# EAGLE schematic container-schematic (EAGLE 9.6.2)
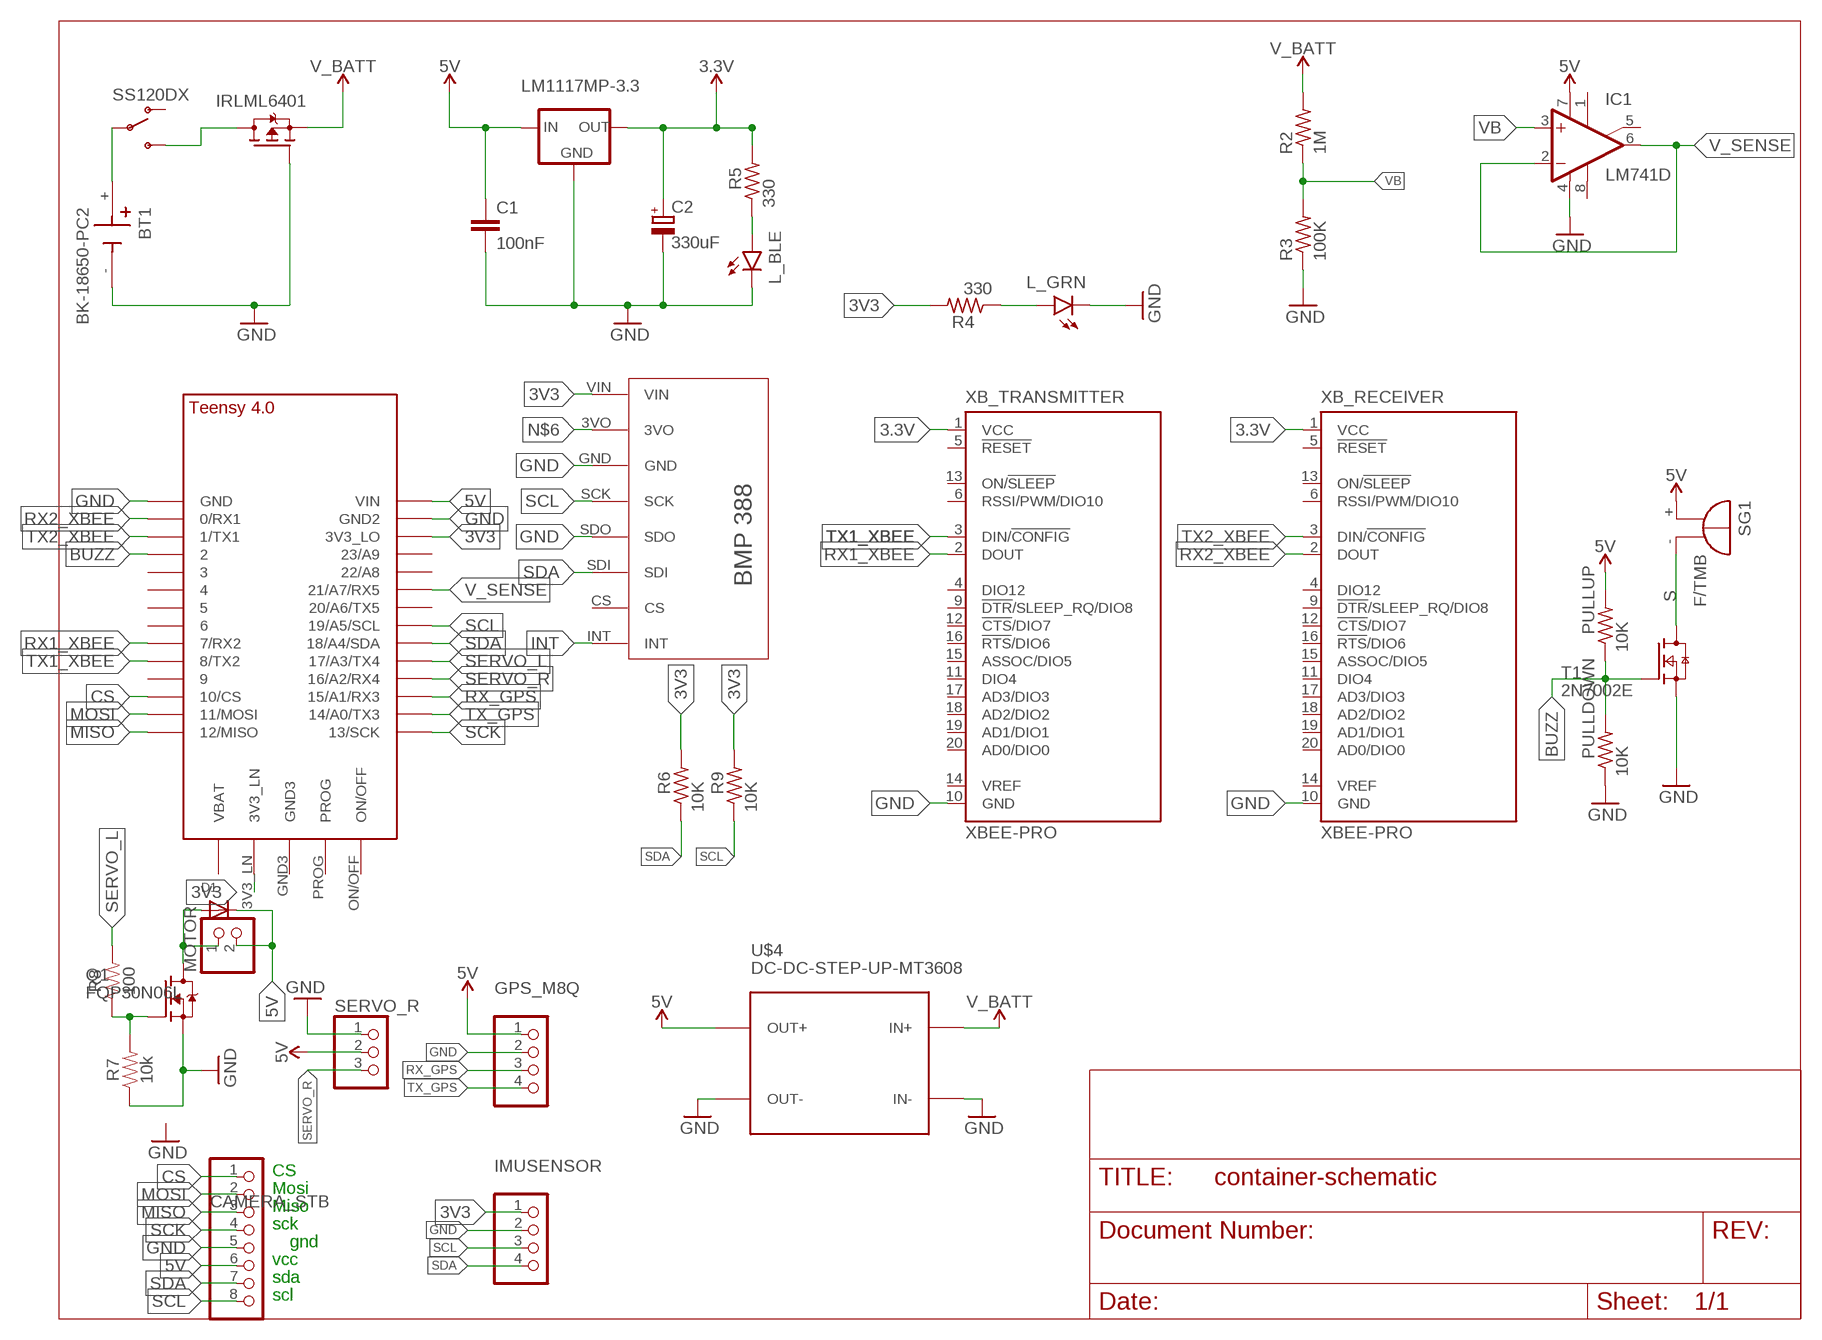
[diagram p0: schematic, sheet 1]

## Parts
BT1  BK-18650-PC2  [BAT_BK-18650-PC2]
C1  100nF  C-EUC0805  [C0805]
C2  330uF  CPOL-EUD/7343-31W  [D/7343-31W]
CAMERA_STB  PINHD-1X8  [1X08]
D1  DIODEDO-1N4148  [DO-1N4148]
GPS_M8Q  PINHD-1X4  [1X04]
IC1  LM741D  [SO08]
IC2  LM1117MP-3.3  [SOT223]
IMUSENSOR  PINHD-1X4  [1X04]
IRLML6401  MOSFET-PWIDE  [SOT23-WIDE]
L_BLE  LED1206  [LED-1206]
L_GRN  LED1206  [LED-1206]
MOTOR  PINHD-1X2  [1X02]
PULLDOWN  10K  R-US_M0805  [M0805]
PULLUP  10K  R-US_M0805  [M0805]
Q1  FQP30N06L  [TO220V]
R2  1M  R-US_M1206  [M1206]
R3  100K  R-US_M1206  [M1206]
R4  330  R-US_M0805  [M0805]
R5  330  R-US_M0805  [M0805]
R6  10K  R-US_M0805  [M0805]
R7  10k  RESISTOR0805  [0805]
R8  100  RESISTOR0805  [0805]
R9  10K  R-US_M0805  [M0805]
SERVO_R  PINHD-1X3  [1X03]
SG1  F/TMB  [F/TMB]
T1  2N7002E  [SOT23]
U$1  TEENSY_4.0-BASIC  [TEENSY_4.0-BASIC]
U$2  BMP388  [BMP388]
U$3  SS120DX  [SS12D0X]
U$4  DC-DC-STEP-UP-MT3608  [DC-DC-STEP-UP-MT3608]
XB_RECEIVER  XBEE-PRO  [XBEE-PRO]
XB_TRANSMITTER  XBEE-PRO  [XBEE-PRO]

## Nets
3.3V: C2.+ IC2.2(OUT) IC2.4(OUT) R5.2 XB_RECEIVER.1(VCC) XB_TRANSMITTER.1(VCC)
3V3: IMUSENSOR.1 R4.2 R6.2 R9.2 U$1.3V3_LN U$1.3V3_LO U$2.VIN
5V: C1.1 CAMERA_STB.6 D1.C GPS_M8Q.1 IC1.7(V+) IC2.3(IN) MOTOR.2 PULLUP.2 SERVO_R.2 SG1.+ U$1.VIN U$4.OUT+
BUZZ: PULLDOWN.2 PULLUP.1 T1.1(G) U$1.2
CS: CAMERA_STB.1 U$1.10/CS
GND: BT1.- C1.2 C2.- CAMERA_STB.5 GPS_M8Q.2 IC1.4(V-) IC2.1(GND) IMUSENSOR.2 IRLML6401.1(G) L_BLE.C L_GRN.C PULLDOWN.1 Q1.3(S) R3.1 R7.1 SERVO_R.1 T1.2(S) U$1.GND U$1.GND2 U$2.GND U$2.SDO U$4.IN- U$4.OUT- XB_RECEIVER.10(GND) XB_TRANSMITTER.10(GND)
INT: U$2.INT
MISO: CAMERA_STB.3 U$1.12/MISO
MOSI: CAMERA_STB.2 U$1.11/MOSI
N$1: IRLML6401.3(D) U$3.3
N$2: Q1.1(G) R7.2 R8.1
N$4: L_GRN.A R4.1
N$5: D1.A MOTOR.1 Q1.2(D)
N$6: U$2.3VO
N$17: L_BLE.A R5.1
NSSS: BT1.+ U$3.2
RX1_XBEE: U$1.7(7/RX2) XB_TRANSMITTER.2(DOUT)
RX2_XBEE: U$1.0/RX(0/RX1) XB_RECEIVER.2(DOUT)
RX_GPS: GPS_M8Q.3 U$1.15/A1(15/A1/RX3)
S: SG1.- T1.3(D)
SCK: CAMERA_STB.4 U$1.13/SCK
SCL: CAMERA_STB.8 IMUSENSOR.3 R9.1 U$1.19/A5/SCL U$2.SCK
SDA: CAMERA_STB.7 IMUSENSOR.4 R6.1 U$1.18/A4/SDA U$2.SDI
SERVO_L: R8.2 U$1.17/A3(17/A3/TX4)
SERVO_R: SERVO_R.3 U$1.16/A2(16/A2/RX4)
TX1_XBEE: U$1.8(8/TX2) XB_TRANSMITTER.3(DIN/!CONFIG)
TX2_XBEE: U$1.1/TX(1/TX1) XB_RECEIVER.3(DIN/!CONFIG)
TX_GPS: GPS_M8Q.4 U$1.14/A0(14/A0/TX3)
V_BATT: IRLML6401.2(S) R2.2 U$4.IN+
V_SENSE: IC1.2(-IN) IC1.6(OUT) U$1.21/A7(21/A7/RX5)
VB: IC1.3(+IN) R2.1 R3.2
Unconnected: IC1.1(ON1) IC1.5(ON2) IC1.8(OPT) U$1.3/CANTX U$1.4/CANRX U$1.5 U$1.6 U$1.9/CS U$1.20/A6(20/A6/TX5) U$1.22/A8 U$1.23/A9 U$1.GND3 U$1.ON/OFF U$1.PROG U$1.VBAT\(VBAT) U$2.CS U$3.1 XB_RECEIVER.4(DIO12) XB_RECEIVER.5(!RESET) XB_RECEIVER.6(RSSI/PWM/DIO10) XB_RECEIVER.9(!DTR!/SLEEP_RQ/DIO8) XB_RECEIVER.11(DIO4) XB_RECEIVER.12(!CTS!/DIO7) XB_RECEIVER.13(ON/!SLEEP) XB_RECEIVER.14(VREF) XB_RECEIVER.15(ASSOC/DIO5) XB_RECEIVER.16(!RTS!/DIO6) XB_RECEIVER.17(AD3/DIO3) XB_RECEIVER.18(AD2/DIO2) XB_RECEIVER.19(AD1/DIO1) XB_RECEIVER.20(AD0/DIO0) XB_TRANSMITTER.4(DIO12) XB_TRANSMITTER.5(!RESET) XB_TRANSMITTER.6(RSSI/PWM/DIO10) XB_TRANSMITTER.9(!DTR!/SLEEP_RQ/DIO8) XB_TRANSMITTER.11(DIO4) XB_TRANSMITTER.12(!CTS!/DIO7) XB_TRANSMITTER.13(ON/!SLEEP) XB_TRANSMITTER.14(VREF) XB_TRANSMITTER.15(ASSOC/DIO5) XB_TRANSMITTER.16(!RTS!/DIO6) XB_TRANSMITTER.17(AD3/DIO3) XB_TRANSMITTER.18(AD2/DIO2) XB_TRANSMITTER.19(AD1/DIO1) XB_TRANSMITTER.20(AD0/DIO0)

## Notes on the sheet
- CS
- Mosi
- Miso
- sck
- gnd
- vcc
- sda
- scl

## Library data of the parts
BT1 = BK-18650-PC2:BK-18650-PC2: Battery Holder (Open) 18650 1 Cell PC Pin Check prices <https://pricing.snapeda.com/parts/BK-18650-PC2/MPD%20%28Memory%20Protection%20Devices%29/view-part?ref=eda>; AVAILABILITY: Warning; DESCRIPTION: Battery Holder (Open) 18650 1 Cell PC Pin; MF: MPD (Memory Protection Devices); MP: BK-18650-PC2; PACKAGE: None; PRICE: None; PURCHASE-URL: https://pricing.snapeda.com/search/part/BK-18650-PC2/?ref=eda
C1 = rcl:C-EU: CAPACITOR, European symbol; SPICEPREFIX: C
C2 = rcl:CPOL-EU: POLARIZED CAPACITOR, European symbol; SPICEPREFIX: C
CAMERA_STB = pinhead:PINHD-1X8: PIN HEADER
D1 = adafruit:DIODE: Diode SMADIODE - SMA Surface Mount Package 20V 1A Schottky Diode Digikey: 641-1014-6-ND DO-1N4148 - Through Hole Small Current Diode SOD-123 20V 1 A (.5mV Vf) Schottky Diode - Digikey: MBRX120TPMSCT-ND SOD-323 10V 570mA (.38mV Vf, 3ns) Schottky Diode - Digikey: ZLLS410CT-ND SOD-523 30V 30mA Schottky Diode (RB751S-40TE61) - Digikey: RB751S-40TE61CT-ND SOT23-R/W - SOT23 Package (R = Solder Paste/Reflow Ovens, W = Hand-Soldering) BAT54Film 40V 300mA - Digikey: 497-7162-1-ND
GPS_M8Q IMUSENSOR = pinhead:PINHD-1X4: PIN HEADER
IC1 = linear:*741: OP AMP
IC2 = lm1117_10:LM1117?-*: 800mA Low-Dropout Linear Regulator Source: http://www.ti.com/lit/ds/symlink/lm1117-n.pdf; MF: Texas Instruments; MPN: LM1117MP-3.3; OC_FARNELL: 9778195; OC_NEWARK: 28X3416
IRLML6401 = microbuilder:MOSFET-P: P-Channel Mosfet LEGEND VDS: Voltage Drain-Source ID: Drain Current RDS(ON): Drain-Source On-State Resistance VGS(TH): Gate-Source Threshold Voltage CISS: Drain-Source Input Capacitance SOT-23 Name VDS ID RDS(ON) VGS(TH) CISS Order Number IRLML5103 30V 760mA 600 mOhm -- 75pF @ 25V Digikey: IRLML5103PBFCT-ND IRLML6401 12V 4.3A 50 mOhm 950mV @ 250µA 830pF @ 10V Digikey: IRLML6401PBFTR-ND NTR0202PL 20V 400mA 800 mOhm 2.3V @ 250uA 70pF @ 5V Digikey: NTR0202PLT1GOSTR-ND NTR4101PT1G 20V 1.8A 85 mOhm 1.2V @ 250uA 675pF @ 10V Digikey: NTR4101PT1GOSCT-ND DMP2004K 20V 600mA 900 mOhm 1V @ 250uA 175pF @ 16V Digikey: DMP2004KDICT-ND PMV65XP 20V 3.9A 76 mOhm 950mV @ 1mA 725pF @ 20V Digikey: 568-2358-2-ND TO-252 Name VDS ID RDS(ON) VGS(TH) CISS Order Number AOD417 30V 25A 34 mOhm 3V @ 250µA 920pF @ 15V Digikey: 785-1106-2-ND
L_BLE L_GRN = SparkFun-LED:LED: LED (Generic) Standard schematic elements and footprints for 5mm, 3mm, 1206, and 0603 sized LEDs. Generic LEDs with no color specified.
MOTOR = pinhead:PINHD-1X2: PIN HEADER
PULLDOWN PULLUP R2-R6 R9 = rcl:R-US_: RESISTOR, American symbol; SPICEPREFIX: R
Q1 = FQP30N06L:FQP30N06L: N-Channel QFET® MOSFET Source: Data Sheet Check availability <https://pricing.snapeda.com/parts/FQP30N06L/ON%20Semiconductor/view-part?ref=eda>; AVAILABILITY: In Stock; DESCRIPTION: N-Channel 60 V 32A (Tc) 79W (Tc) Through Hole TO-220-3; MF: ON Semiconductor; MP: FQP30N06L; PACKAGE: TO-220-3 ON Semiconductor; PRICE: None; PURCHASE-URL: https://pricing.snapeda.com/search/part/FQP30N06L/?ref=eda
R7 R8 = SparkFun-Resistors:RESISTOR: Generic Resistor Package
SERVO_R = pinhead:PINHD-1X3: PIN HEADER
SG1 = buzzer:F/TMB: BUZZER Source: Buerklin; OC_FARNELL: unknown; OC_NEWARK: unknown
T1 = nxp_60:2N7002: N-channel TrenchMOS FET N-channel enhancement mode Field-Effect Transistor (FET) in a plastic package using TrenchMOS technology. AAL Eindhoven MK
U$1 = Teensy-4.0:TEENSY_4.0-BASIC
U$2 = mario:BMP388
U$3 = mario:SS120DX
U$4 = diy-modules:DC-DC-STEP-UP-MT3608: DC/DC Step-Up Regulator based on MT3608 chip MT3608 datasheet available here: https://www.olimex.com/Products/Breadboarding/BB-PWR-3608/resources/MT3608.pdf Click here to find device on ebay.com <http://www.ebay.com/sch/mt3608+module>
XB_RECEIVER XB_TRANSMITTER = xbee:XBEE: XBee (TM) /XBee-PRO(TM) OEM RF Modules Source: MaxStream, Inc. xbee_productmanual.pdf; MPN: XBP24-AWI-001; OC_FARNELL: 1337916; OC_NEWARK: 42M2667